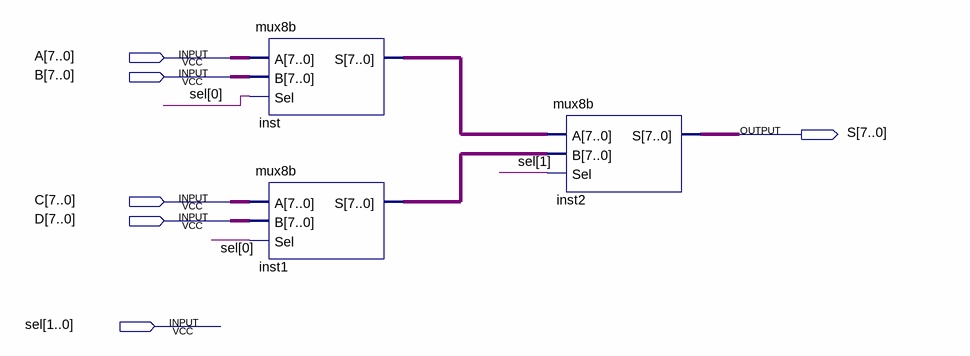
[diagram p0: schematic sheet]
// Quartus schematic mux8b4.bdf as structural Verilog: 3 symbols, 6 pins
module mux8b4 (
  input  [7:0] A,
  input  [7:0] B,
  input  [7:0] C,
  input  [7:0] D,
  input  [1:0] sel,
  output [7:0] S
);

  wire [7:0] inst1_s, inst_s;

  mux8b inst (.A(A), .B(B), .Sel(sel[0]), .S(inst_s));
  mux8b inst1 (.A(C), .B(D), .Sel(sel[0]), .S(inst1_s));
  mux8b inst2 (.A(inst_s), .B(inst1_s), .Sel(sel[1]), .S(S));
endmodule
